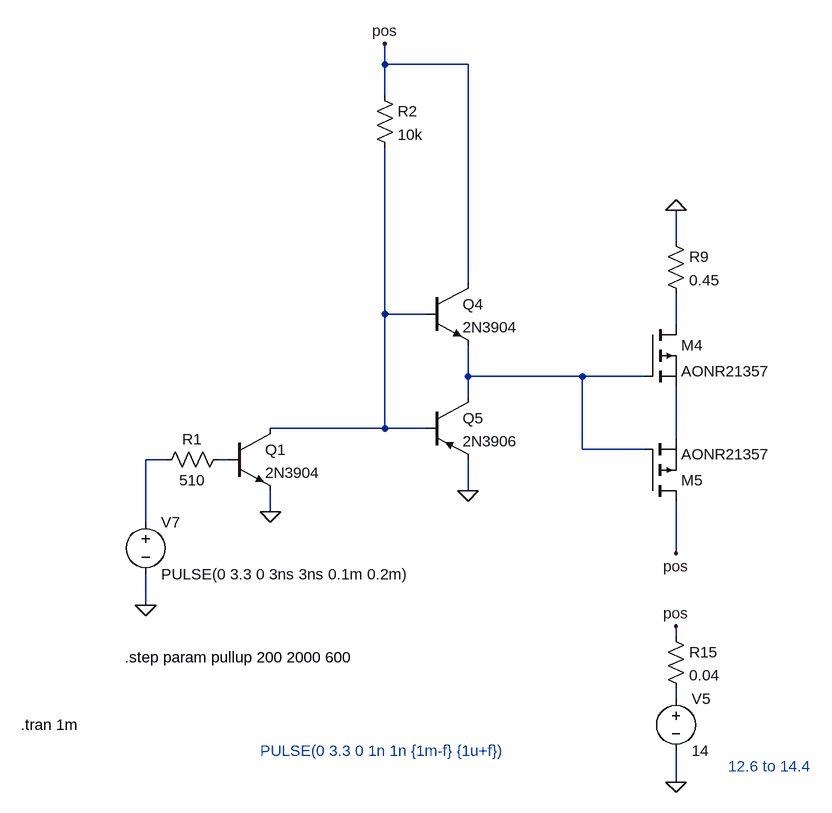
[diagram p0: schematic MOSFET switch circuit.asc]
MOSFET switch circuit.asc, the LTspice schematic file:
Version 4
SHEET 1 880 680
WIRE -1456 -464 -1456 -496
WIRE -1328 -464 -1456 -464
WIRE -1456 -416 -1456 -464
WIRE -1008 -192 -1008 -240
WIRE -1328 -128 -1328 -464
WIRE -1456 -80 -1456 -336
WIRE -1392 -80 -1456 -80
WIRE -1008 -64 -1008 -112
WIRE -1328 16 -1328 -32
WIRE -1152 16 -1328 16
WIRE -1056 16 -1152 16
WIRE -1328 48 -1328 16
WIRE -1456 96 -1456 -80
WIRE -1456 96 -1632 96
WIRE -1392 96 -1456 96
WIRE -1008 112 -1008 32
WIRE -1152 128 -1152 16
WIRE -1056 128 -1152 128
WIRE -1792 144 -1824 144
WIRE -1696 144 -1712 144
WIRE -1328 192 -1328 144
WIRE -1632 224 -1632 192
WIRE -1824 240 -1824 144
WIRE -1008 288 -1008 208
WIRE -1824 368 -1824 320
WIRE -1008 416 -1008 400
WIRE -1008 512 -1008 496
WIRE -1008 640 -1008 592
FLAG -1824 368 0
FLAG -1008 640 0
FLAG -1008 288 pos
FLAG -1008 -240 0
FLAG -1008 400 pos
FLAG -1328 192 0
FLAG -1456 -496 pos
FLAG -1632 224 0
SYMBOL voltage -1008 496 R0
WINDOW 123 0 0 Left 0
WINDOW 39 0 0 Left 0
SYMATTR InstName V5
SYMATTR Value 14
SYMBOL pmos -1056 -64 R0
SYMATTR InstName M4
SYMATTR Value AONR21357
SYMBOL pmos -1056 208 M180
SYMATTR InstName M5
SYMATTR Value AONR21357
SYMBOL res -1024 -208 R0
SYMATTR InstName R9
SYMATTR Value 0.45
SYMBOL npn -1392 -128 R0
WINDOW 0 56 33 Left 2
SYMATTR InstName Q4
SYMATTR Value 2N3904
SYMBOL voltage -1824 224 R0
WINDOW 123 0 0 Left 0
WINDOW 39 0 0 Left 0
SYMATTR InstName V7
SYMATTR Value PULSE(0 3.3 0 3ns 3ns 0.1m 0.2m)
SYMBOL res -1024 400 R0
SYMATTR InstName R15
SYMATTR Value 0.04
SYMBOL pnp -1392 48 R0
SYMATTR InstName Q5
SYMATTR Value 2N3906
SYMBOL res -1472 -432 R0
SYMATTR InstName R2
SYMATTR Value 10k
SYMBOL npn -1696 96 R0
WINDOW 0 56 33 Left 2
SYMATTR InstName Q1
SYMATTR Value 2N3904
SYMBOL res -1696 128 R90
WINDOW 0 0 56 VBottom 2
WINDOW 3 32 56 VTop 2
SYMATTR InstName R1
SYMATTR Value 510
TEXT -2016 552 Left 2 !.tran 1m
TEXT -1856 448 Left 2 !.step param pullup 200 2000 600
TEXT -928 616 Left 2 ;12.6 to 14.4
TEXT -1648 592 Left 2 ;PULSE(0 3.3 0 1n 1n {1m-f} {1u+f})

The netlist it stands for:
* MOSFET switch circuit.asc
V5 N007 0 14
M4 N002 N003 N004 N004 AONR21357
M5 pos N003 N004 N004 AONR21357
R9 0 N002 0.45
Q4 pos N001 N003 0 2N3904
V7 N005 0 PULSE(0 3.3 0 3ns 3ns 0.1m 0.2m)
R15 pos N007 0.04
Q5 N003 N001 0 0 2N3906
R2 pos N001 10k
Q1 N001 N006 0 0 2N3904
R1 N006 N005 510
.model NPN NPN
.model PNP PNP
.lib standard.bjt
.model NMOS NMOS
.model PMOS PMOS
.lib standard.mos
.tran 1m
.step param pullup 200 2000 600
* 12.6 to 14.4
* PULSE(0 3.3 0 1n 1n {1m-f} {1u+f})
.backanno
.end